# EAGLE design mainboard (EAGLE 7.7.0)
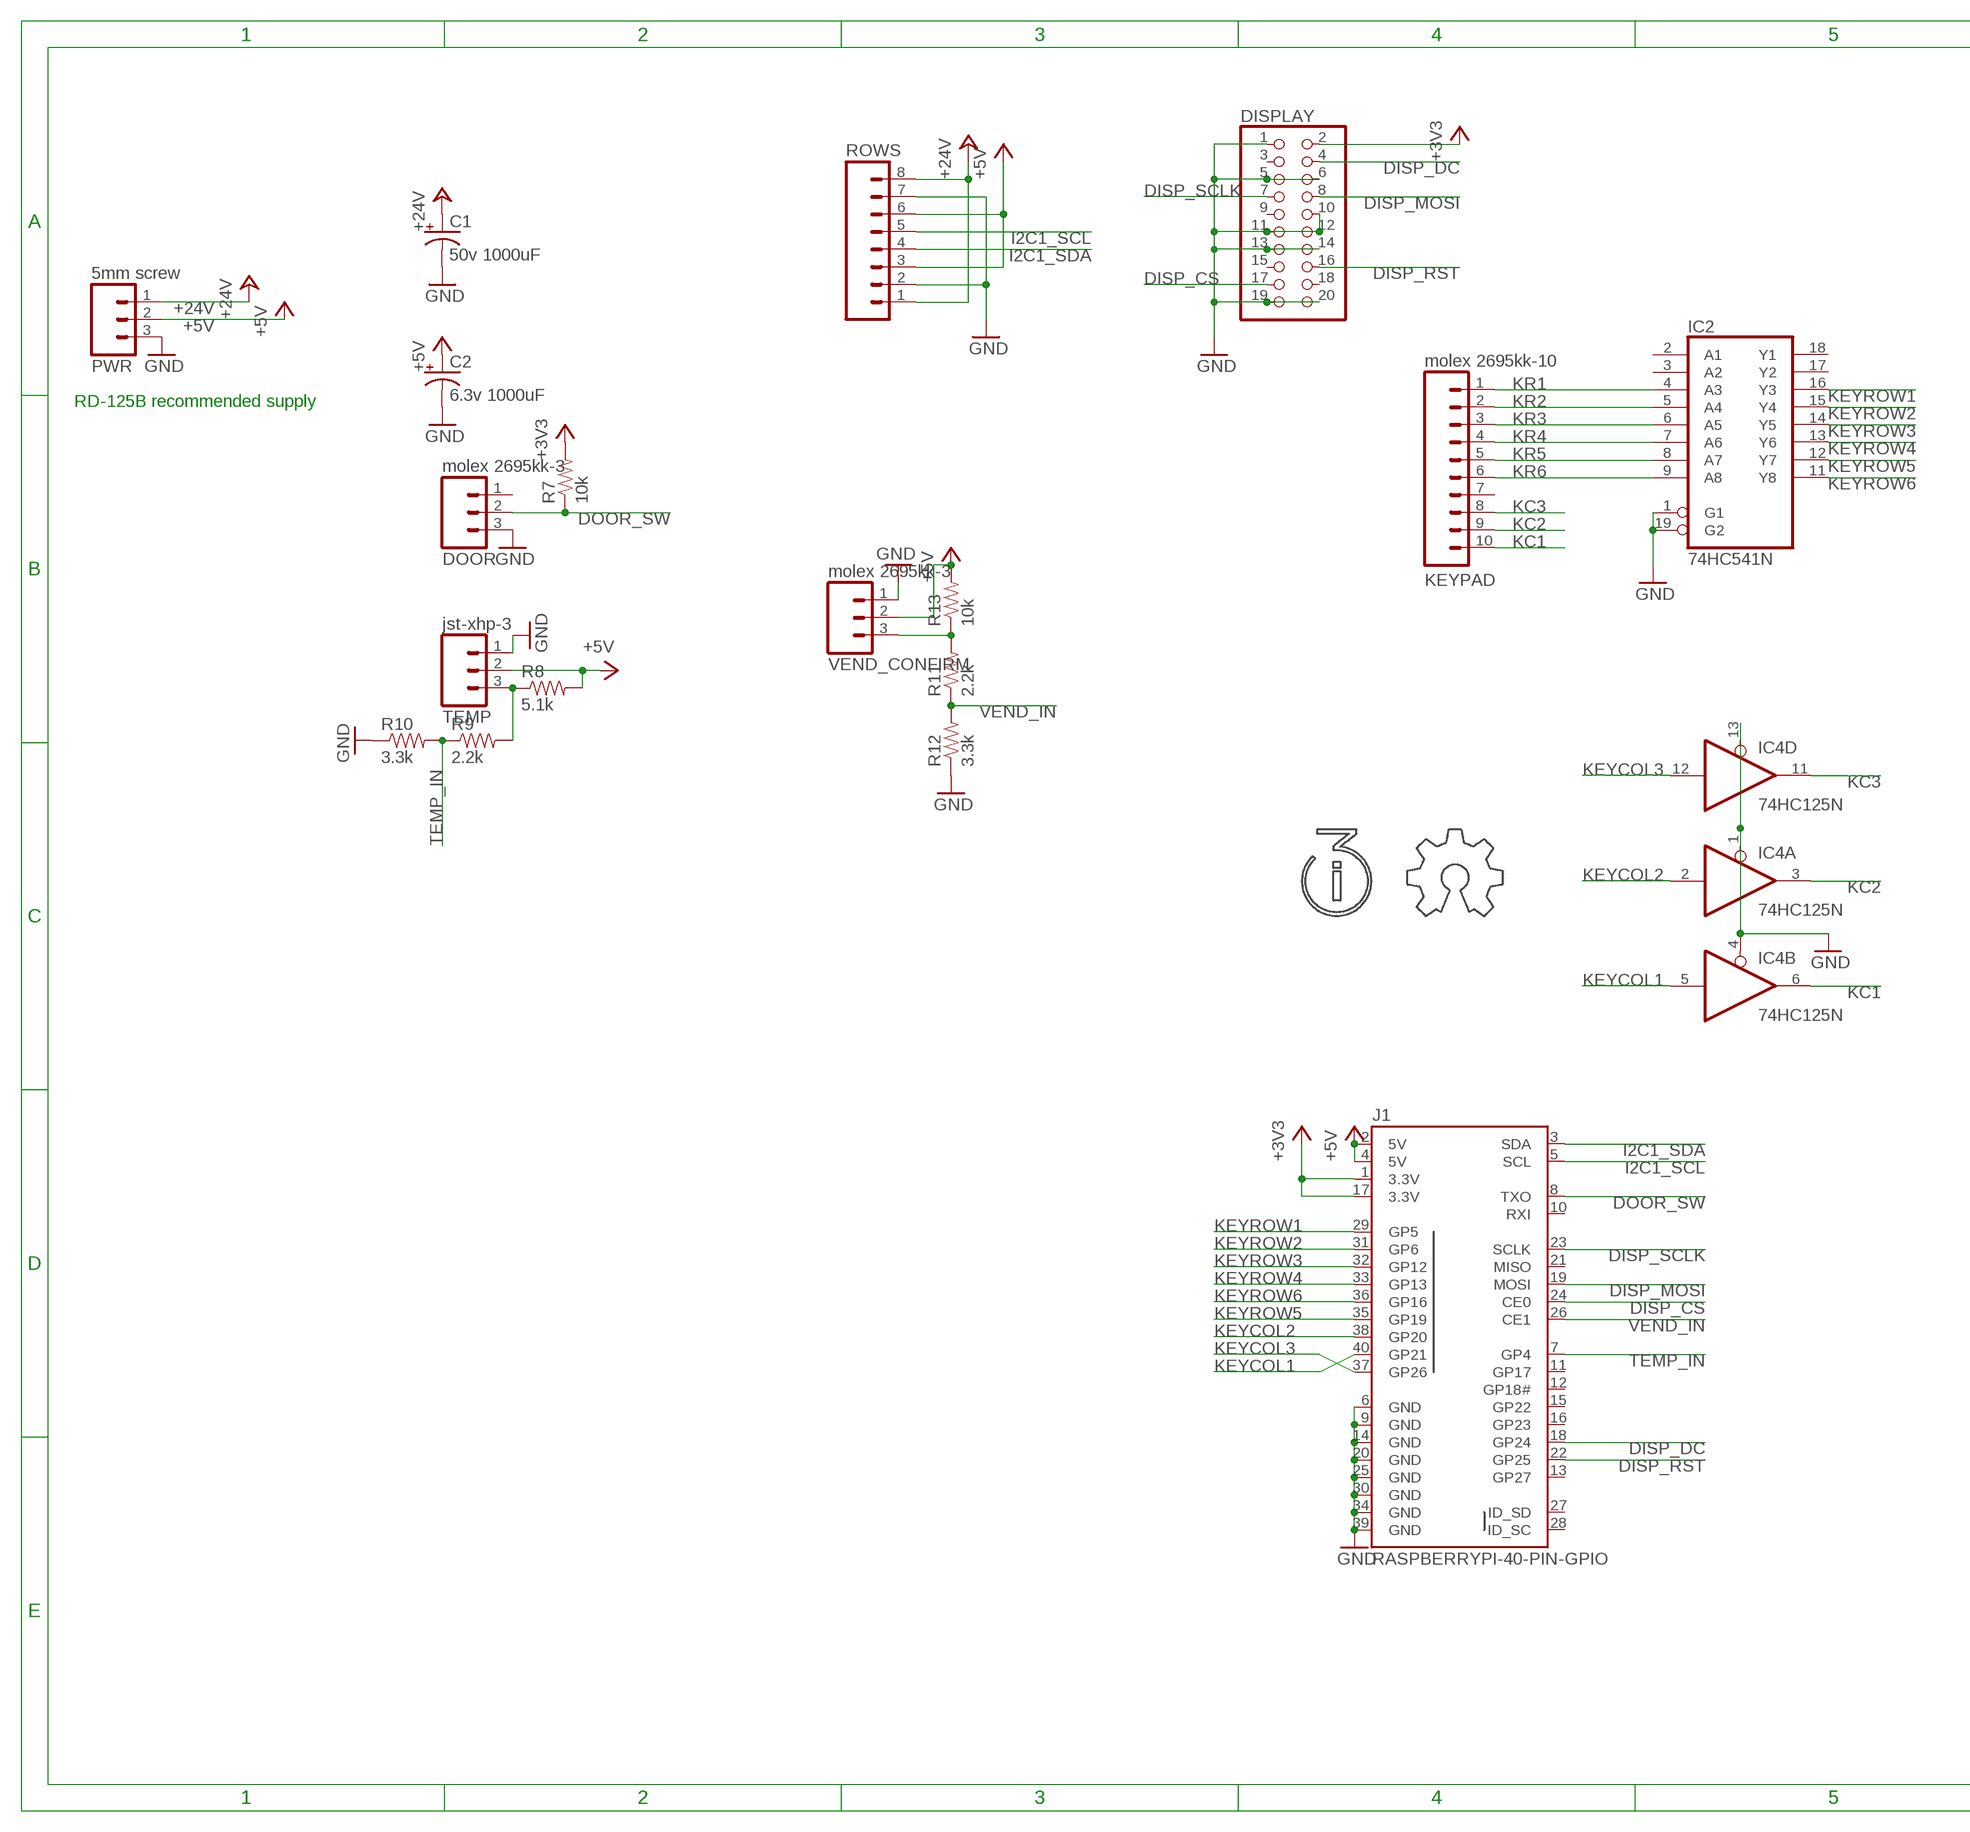
[diagram p0: schematic, sheet 1, part 1 of 2]
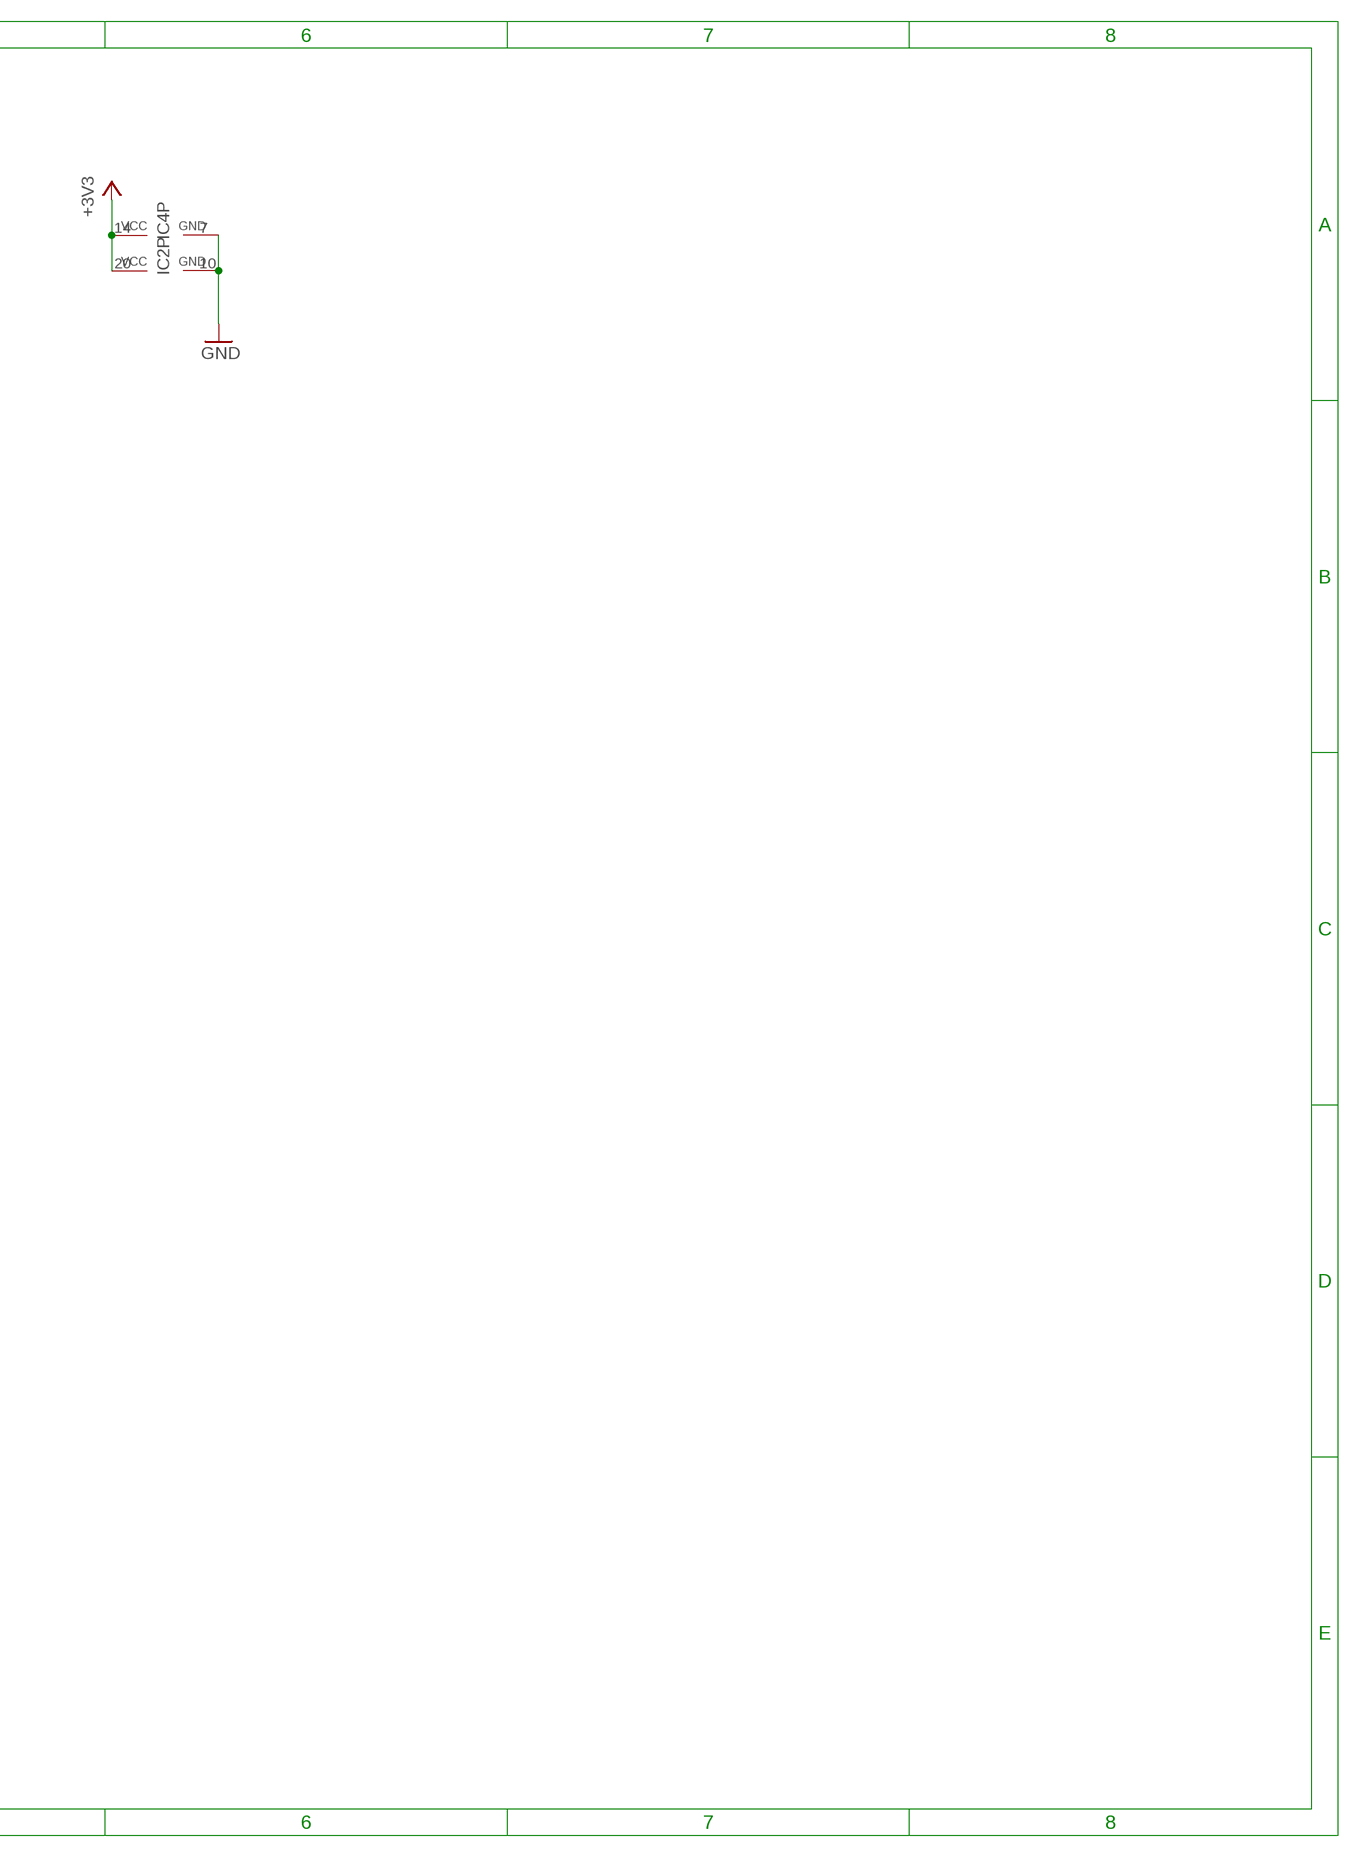
[diagram p1: schematic, sheet 1, part 2 of 2]

## Parts
C1  50v 1000uF  CAP_POLPTH4  [CPOL-RADIAL-1000UF-25V]
C2  6.3v 1000uF  CAP_POLPTH4  [CPOL-RADIAL-1000UF-25V]
DISPLAY  PINHD-2X10  [2X10]
DOOR  molex 2695kk-3  M03POLAR  [MOLEX-1X3]
IC2  74HC541N  [DIL20]
IC4  74HC125N  [DIL14]
J1  RASPBERRYPI-40-PIN-GPIO  [2X20-SHROUDED]
KEYPAD  molex 2695kk-10  M10LOCK  [1X10_LOCK]
PWR  5mm screw  M03-SCREW-5MM  [SCREWTERMINAL-5MM-3]
R7  10k  RESISTOR1206  [1206]
R8  5.1k  RESISTOR1206  [1206]
R9  2.2k  RESISTOR1206  [1206]
R10  3.3k  RESISTOR1206  [1206]
R11  2.2k  RESISTOR1206  [1206]
R12  3.3k  RESISTOR1206  [1206]
R13  10k  RESISTOR1206  [1206]
ROWS  M08FEMALE_LOCK  [1X08_FEMALE_LOCK]
TEMP  jst-xhp-3  M03PTH  [1X03]
U$1  I3LOGO  [I3LOGO]
U$2  OSHWLOGO  [OSHWLOGO]
VEND_CONFIRM  molex 2695kk-3  M03POLAR  [MOLEX-1X3]

## Nets
+3V3: DISPLAY.2 IC2.20(VCC) IC4.14(P:VCC) J1.1(3.3V) J1.17(3.3V) R7.2
+5V: C2.+ J1.2(5V) J1.4(5V) PWR.2 R8.2 R13.2 ROWS.3 ROWS.6 TEMP.2 VEND_CONFIRM.2
+24V: C1.+ PWR.1 ROWS.1 ROWS.8
DISP_CS: DISPLAY.17 J1.24(CE0)
DISP_DC: DISPLAY.4 J1.18(GP24)
DISP_MOSI: DISPLAY.8 J1.19(MOSI)
DISP_RST: DISPLAY.16 J1.22(GP25)
DISP_SCLK: DISPLAY.7 J1.23(SCLK)
DOOR_SW: DOOR.2 J1.8(TXO) R7.1
GND: C1.- C2.- DISPLAY.1 DISPLAY.5 DISPLAY.6 DISPLAY.10 DISPLAY.11 DISPLAY.12 DISPLAY.13 DISPLAY.14 DISPLAY.19 DISPLAY.20 DOOR.3 IC2.1(G1) IC2.10(GND) IC2.19(G2) IC4.1(A:OE) IC4.4(B:OE) IC4.7(P:GND) IC4.13(D:OE) J1.6(GND) J1.9(GND) J1.14(GND) J1.20(GND) J1.25(GND) J1.30(GND) J1.34(GND) J1.39(GND) PWR.3 R10.1 R12.1 ROWS.2 ROWS.7 TEMP.1 VEND_CONFIRM.1
I2C1_SCL: J1.5(SCL) ROWS.5
I2C1_SDA: J1.3(SDA) ROWS.4
KC1: IC4.6(B:O) KEYPAD.10
KC2: IC4.3(A:O) KEYPAD.9
KC3: IC4.11(D:O) KEYPAD.8
KEYCOL1: IC4.5(B:I) J1.40(GP21)
KEYCOL2: IC4.2(A:I) J1.38(GP20)
KEYCOL3: IC4.12(D:I) J1.37(GP26)
KEYROW1: IC2.16(Y3) J1.29(GP5)
KEYROW2: IC2.15(Y4) J1.31(GP6)
KEYROW3: IC2.14(Y5) J1.32(GP12)
KEYROW4: IC2.13(Y6) J1.33(GP13)
KEYROW5: IC2.12(Y7) J1.35(GP19)
KEYROW6: IC2.11(Y8) J1.36(GP16)
KR1: IC2.4(A3) KEYPAD.1
KR2: IC2.5(A4) KEYPAD.2
KR3: IC2.6(A5) KEYPAD.3
KR4: IC2.7(A6) KEYPAD.4
KR5: IC2.8(A7) KEYPAD.5
KR6: IC2.9(A8) KEYPAD.6
N$1: R8.1 R9.2 TEMP.3
N$5: R11.2 R13.1 VEND_CONFIRM.3
TEMP_IN: J1.7(GP4) R9.1 R10.2
VEND_IN: J1.26(CE1) R11.1 R12.2
Unconnected: DISPLAY.3 DISPLAY.9 DISPLAY.15 DISPLAY.18 DOOR.1 IC2.2(A1) IC2.3(A2) IC2.17(Y2) IC2.18(Y1) IC4.8(C:O) IC4.9(C:I) IC4.10(C:OE) J1.10(RXI) J1.11(GP17) J1.12(GP18#) J1.13(GP27) J1.15(GP22) J1.16(GP23) J1.21(MISO) J1.27(ID_SD) J1.28(ID_SC) KEYPAD.7

## Notes on the sheet
- RD-125B recommended supply

## Library data of the parts
C1 C2 = SparkFun-Capacitors:CAP_POL: Capacitor Polarized These are standard SMD and PTH capacitors. Normally 10uF, 47uF, and 100uF in electrolytic and tantalum varieties. Always verify the external diameter of the through hole cap, it varies with capacity, voltage, and manufacturer. The EIA devices should be standard.
DISPLAY = SparkFun-Connectors:PINHD-2X10: PIN HEADER
DOOR TEMP VEND_CONFIRM = SparkFun-Connectors:M03: Header 3 Standard 3-pin 0.1" header. Use with straight break away headers (SKU : PRT-00116), right angle break away headers (PRT-00553), swiss pins (PRT-00743), machine pins (PRT-00117), and female headers (PRT-00115). Molex polarized connector foot print use with SKU : PRT-08232 with associated crimp pins and housings.
IC2 = 74xx-eu:74*541: Octal BUFFER and LINE DRIVER, 3-state
IC4 = 74xx-eu:74*125: Quad bus BUFFER, 3-state
J1 = SparkFun-Boards:RASPBERRYPI-40-PIN-GPIO: Second Generation Raspberry Pi GPIO Header 2x20 pin connector, as found on B, B+, A+ models.
KEYPAD = SparkFun-Connectors:M10: Header 10 Standard 10-pin 0.1" header. Use with straight break away headers (SKU : PRT-00116), right angle break away headers (PRT-00553), swiss pins (PRT-00743), machine pins (PRT-00117), and female headers (PRT-00115).
PWR = SparkFun-Connectors:M03: Header 3 Standard 3-pin 0.1" header. Use with straight break away headers (SKU : PRT-00116), right angle break away headers (PRT-00553), swiss pins (PRT-00743), machine pins (PRT-00117), and female headers (PRT-00115). Molex polarized connector foot print use with SKU : PRT-08232 with associated crimp pins and housings.; STOREFRONT_ID: PRT-08433
R7-R13 = SparkFun-Passives:RESISTOR: Resistor Basic schematic elements and footprints for 0603, 1206, and PTH resistors.
ROWS = SparkFun-Connectors:M08: Header 8 Standard 8-pin 0.1" header. Use with straight break away headers (SKU : PRT-00116), right angle break away headers (PRT-00553), swiss pins (PRT-00743), machine pins (PRT-00117), and female headers (PRT-00115).
U$1 = vending:I3LOGO: The i3Detroit square logo ("i3") as lines in the Info/tNames layers
U$2 = vending:OSHWLOGO: The OSHW logo as lines on Info/tNames layers

## Board
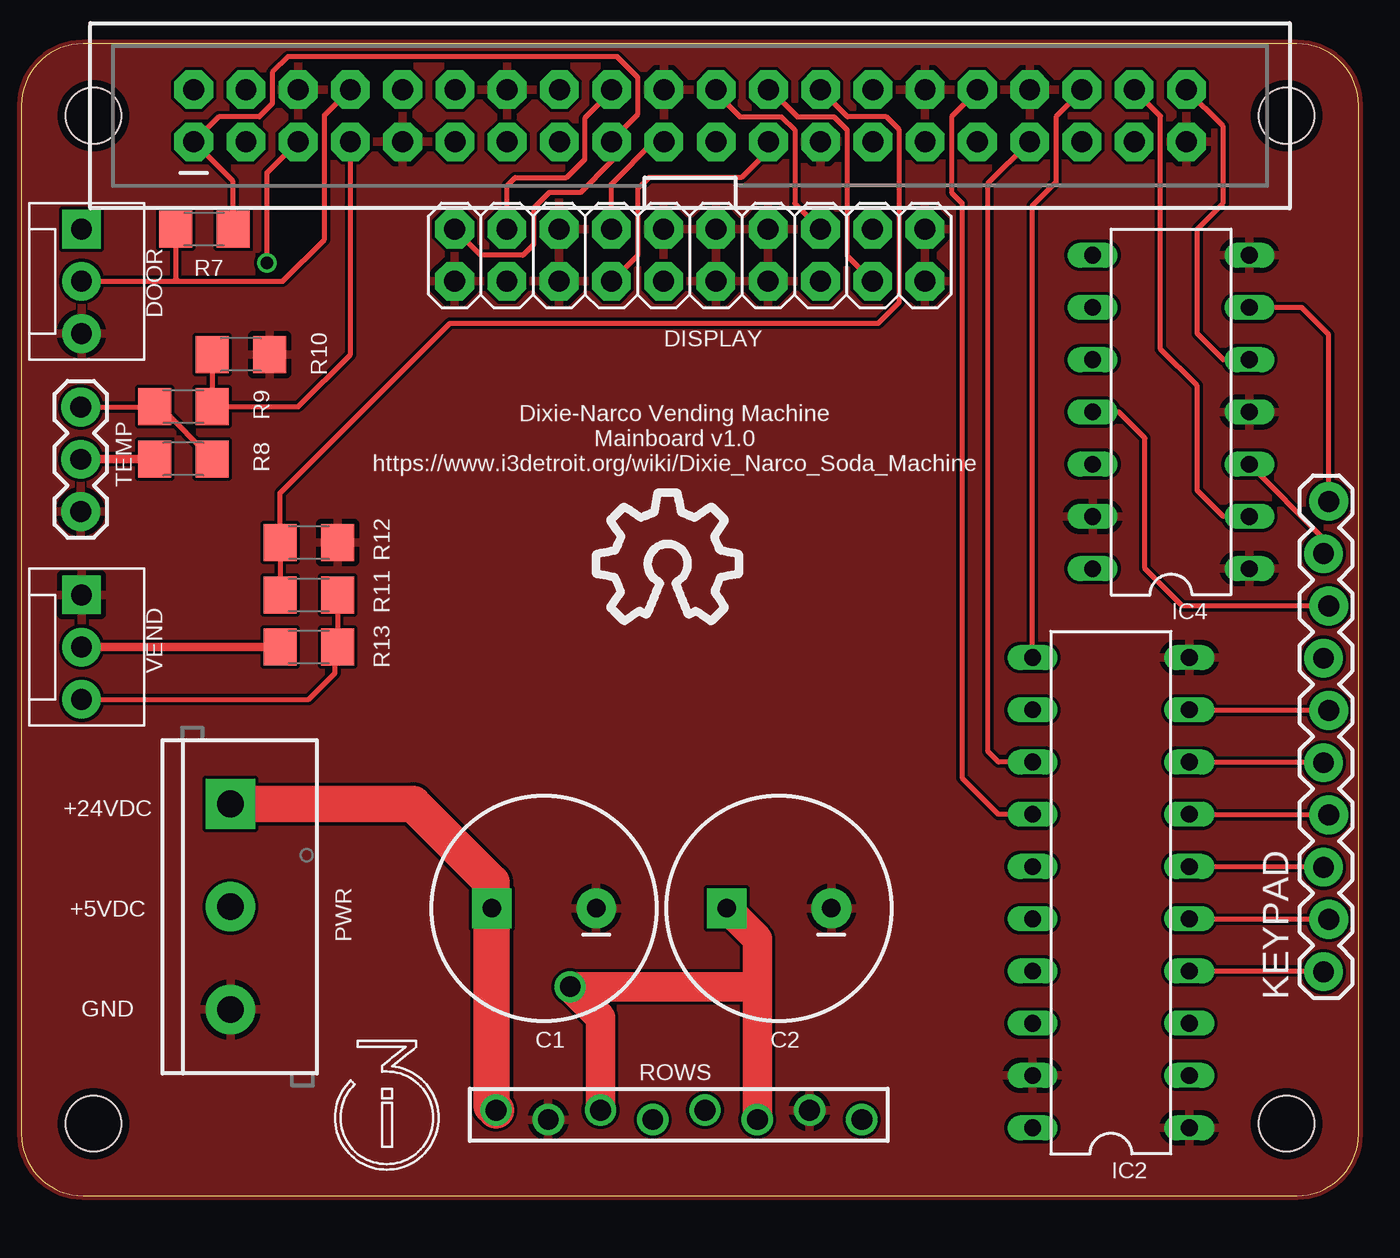
[diagram p2: board, top side]
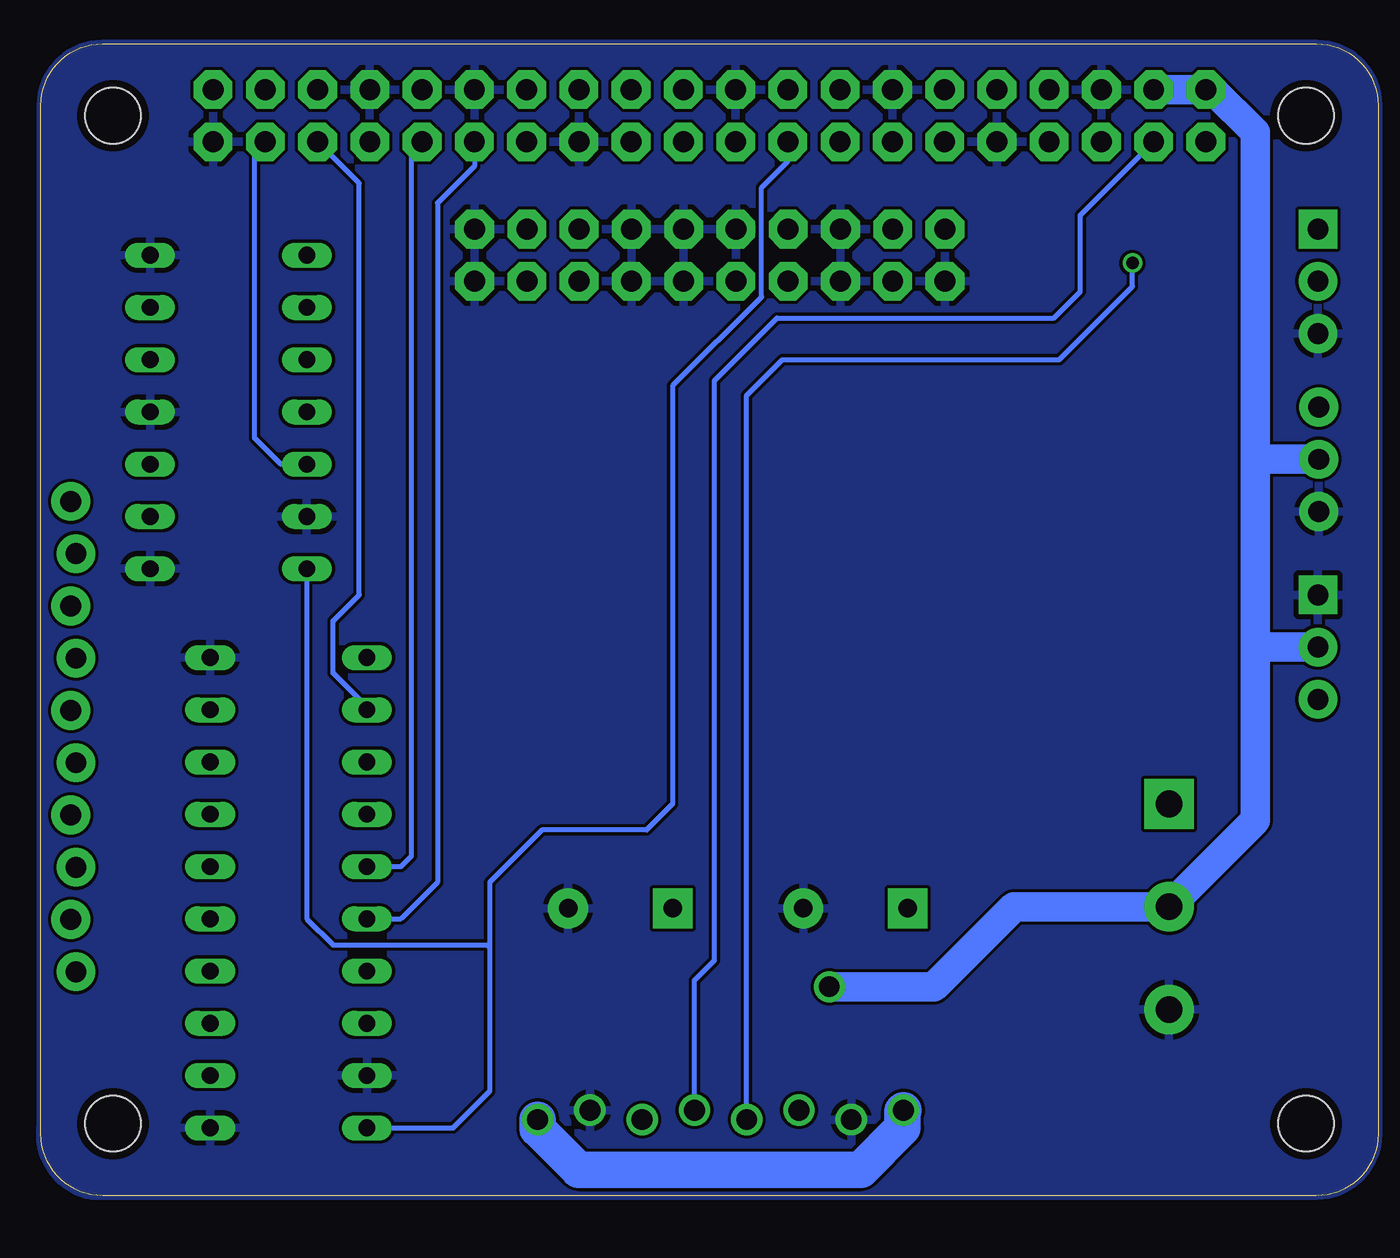
[diagram p3: board, bottom side, seen from below]

No outline drawn. Coordinates in mm, seen from the top.
Copper layers (1*16): Top 0.0356mm / dielectric 1.5011mm / Bottom 0.0356mm
Design rules "LaenPCBOrder *": minimum track width 6mil, minimum drill 13mil, track to track 6mil, track to pad 6mil, pad to pad 6mil, via to via 6mil, smd to smd 6mil, copper to edge 15mil, drill to drill 6mil, minimum pad ring 7mil, minimum via ring 7mil, stop-mask expansion 4mil, vias tented up to drill 0mil, thermal gap 10mil
Holes 2.7 mm at 3.5,3.5 3.5,52.5 61.5,52.5 61.5,3.5
tKeepout: area 61.5,3.5 to 61.5,3.5; area 3.5,3.5 to 3.5,3.5
bKeepout: area 61.5,3.5 to 61.5,3.5; area 3.5,3.5 to 3.5,3.5
Milling: 8 lines

### Footprints (pad centres in the part's own frame; a part is rotated, then mirrored left to right if it is on the bottom)
CPOL-RADIAL-1000UF-25V = drill 0.9 pad 1.93 square: + 2.54,0 | drill 0.9 pad 1.93: - -2.54,0
2X10 = drill 1.016 pad 1.88 octagon: 1 -11.43,-1.27; 2 -11.43,1.27; 3 -8.89,-1.27; 4 -8.89,1.27; 5 -6.35,-1.27; 6 -6.35,1.27; 7 -3.81,-1.27; 8 -3.81,1.27; 9 -1.27,-1.27; 10 -1.27,1.27; 11 1.27,-1.27; 12 1.27,1.27; 13 3.81,-1.27; 14 3.81,1.27; 15 6.35,-1.27; 16 6.35,1.27; 17 8.89,-1.27; 18 8.89,1.27; 19 11.43,-1.27; 20 11.43,1.27
MOLEX-1X3 = drill 1.016 pad 1.88 square: 1 0,0 | drill 1.016 pad 1.88: 2 2.54,0; 3 5.08,0
DIL20 = drill 0.813 long: 1 -11.43,-3.81; 2 -8.89,-3.81; 3 -6.35,-3.81; 4 -3.81,-3.81; 5 -1.27,-3.81; 6 1.27,-3.81; 7 3.81,-3.81; 8 6.35,-3.81; 9 8.89,-3.81; 10 11.43,-3.81; 11 11.43,3.81; 12 8.89,3.81; 13 6.35,3.81; 14 3.81,3.81; 15 1.27,3.81; 16 -1.27,3.81; 17 -3.81,3.81; 18 -6.35,3.81; 19 -8.89,3.81; 20 -11.43,3.81
DIL14 = drill 0.813 long: 1 -7.62,-3.81; 2 -5.08,-3.81; 3 -2.54,-3.81; 4 0,-3.81; 5 2.54,-3.81; 6 5.08,-3.81; 7 7.62,-3.81; 8 7.62,3.81; 9 5.08,3.81; 10 2.54,3.81; 11 0,3.81; 12 -2.54,3.81; 13 -5.08,3.81; 14 -7.62,3.81
2X20-SHROUDED = drill 1.016 pad 1.88 octagon: 1 -1.27,24.13; 2 1.27,24.13; 3 -1.27,21.59; 4 1.27,21.59; 5 -1.27,19.05; 6 1.27,19.05; 7 -1.27,16.51; 8 1.27,16.51; 9 -1.27,13.97; 10 1.27,13.97; 11 -1.27,11.43; 12 1.27,11.43; 13 -1.27,8.89; 14 1.27,8.89; 15 -1.27,6.35; 16 1.27,6.35; 17 -1.27,3.81; 18 1.27,3.81; 19 -1.27,1.27; 20 1.27,1.27; 21 -1.27,-1.27; 22 1.27,-1.27; 23 -1.27,-3.81; 24 1.27,-3.81; 25 -1.27,-6.35; 26 1.27,-6.35; 27 -1.27,-8.89; 28 1.27,-8.89; 29 -1.27,-11.43; 30 1.27,-11.43; 31 -1.27,-13.97; 32 1.27,-13.97; 33 -1.27,-16.51; 34 1.27,-16.51; 35 -1.27,-19.05; 36 1.27,-19.05; 37 -1.27,-21.59; 38 1.27,-21.59; 39 -1.27,-24.13; 40 1.27,-24.13
1X10_LOCK = drill 1.016 pad 1.88: 1 0,0.127; 2 2.54,-0.127; 3 5.08,0.127; 4 7.62,-0.127; 5 10.16,0.127; 6 12.7,-0.127; 7 15.24,0.127; 8 17.78,-0.127; 9 20.32,0.127; 10 22.86,-0.127
SCREWTERMINAL-5MM-3 = drill 1.3 pad 2.413 square: 1 0,0 | drill 1.3 pad 2.413: 2 5,0; 3 10,0
1206 = smd 1.6 x 1.8: 1 -1.4,0; 2 1.4,0
1X08_FEMALE_LOCK = drill 1.016: 1 0,0.229; 2 2.54,-0.229; 3 5.08,0.229; 4 7.62,-0.229; 5 10.16,0.229; 6 12.7,-0.229; 7 15.24,0.229; 8 17.78,-0.229
1X03 = drill 1.016 pad 1.88: 1 0,0; 2 2.54,0; 3 5.08,0

### Placement (x,y rotation side)
C1  25.4,13.97 180 top
C2  36.83,13.97 180 top
DISPLAY  32.49,45.72 0 top
DOOR  2.92,46.99 270 top
IC2  52.96,14.73 90 top
IC4  55.88,38.1 90 top
J1  32.5,52.5 90 top
KEYPAD  63.42,10.89 90 top
PWR  10.16,19.05 270 top
R7  8.89,46.99 0 top
R8  4.7k  [1206]  7.87,35.81 180 top
R9  7.87,38.35 180 top
R10  10.67,40.89 180 top
R11  13.97,29.21 0 top
R12  13.97,31.75 180 top
R13  13.97,26.67 180 top
ROWS  40.85,3.93 180 top
TEMP  2.88,33.26 90 top
U$1  15.24,1.27 0 top
U$2  27.94,27.94 0 top
VEND_CONFIRM  2.92,29.21 270 top

### Tracks (layer width: path | path; a pad name or v marks a point on that pad's centre or on a via)
+3V3
  Top 0.254: DISPLAY.2 22.33,45.72 24.38,45.72 24.89,46.23 24.89,48.01 25.65,48.77 27.18,48.77 28.69,50.28 J1.17 28.69,51.27 28.68,51.28 29.97,52.58 29.97,54.36 28.96,55.37 12.95,55.37 12.19,54.61 12.19,53.09 11.56,52.45 9.59,52.45 J1.1 10.29,49.31 R7.2
  Bottom 0.254: J1.17 28.69,50.28 29.97,49 29.97,43.69 34.29,39.37 34.29,19.05 35.56,17.78 40.64,17.78 43.18,15.24 43.18,12.06 | 43.18,12.06 43.18,5.08 44.96,3.3 IC2.20 | IC4.14 52.07,13.46 50.8,12.19 43.31,12.19 43.18,12.06
+5V  (via drill 1)
  Top 0.254: 2.87,35.81 TEMP.2 | R8.2
  Top 0.406: TEMP.2 R8.2 | VEND_CONFIRM.2 R13.2
  Top 1.422: C2.+ 35.77,12.49 35.77,10.16 | 35.77,10.16 ROWS.3 | 35.77,10.16 v26.67,10.16 28.15,8.68 ROWS.6
  Bottom 0.254: J1.2
  Bottom 1.422: J1.2 8.05,53.77 5.97,51.69 5.97,35.8 | J1.2 J1.4 | v26.67,10.16 21.59,10.16 17.7,14.05 PWR.2 5.97,18.24 5.97,26.67 | 5.97,26.67 5.97,35.8 | 5.97,35.8 TEMP.2 | VEND_CONFIRM.2 5.97,26.67
+24V
  Top 1.778: PWR.1 19.05,19.05 22.86,15.24 C1.+ 22.86,4.37 ROWS.8
  Bottom 1.778: ROWS.1 40.85,3.26 38.86,1.27 25.15,1.27 23.11,3.3 23.11,4.12 ROWS.8
DISP_CS
  Top 0.254: DISPLAY.17 40.13,45.7 40.13,51.82 39.5,52.45 37.72,52.45 36.4,53.77 J1.24
DISP_DC
  Top 0.254: DISPLAY.4 23.6,49.1 24,49.5 26.5,49.5 27.37,50.37 27.37,52.37 28.69,53.69 J1.18
DISP_MOSI
  Top 0.254: DISPLAY.8 28.68,49.18 30.73,51.23 J1.19
DISP_RST
  Top 0.254: DISPLAY.16 37.59,48.23 37.59,51.82 36.96,52.45 34.92,52.45 33.76,53.62 33.77,53.63 J1.22
DISP_SCLK
  Top 0.254: DISPLAY.7 28.7,44.45 29.97,45.72 29.97,48.97 30.5,49.5 35,49.5 36.31,50.81 J1.23
DOOR_SW
  Top 0.254: DOOR.2 7.62,44.45 | 7.62,44.45 12.7,44.45 14.73,46.48 14.73,52.53 14.75,52.53 J1.8 | R7.1 7.49,44.58 7.62,44.45
GND
  pour Bottom: 0,3 arc90 3,0 62.5,0 arc90 65,3.5 65,53 arc90 62,56 3,56 arc90 0,53
  pour Top: 0,53 arc-90 3,56 62,56 arc-90 65,53 65,3 arc-90 62,0 3,0 arc-90 0,3
I2C1_SCL  (via drill 0.6)
  Top 0.254: v11.94,45.34 11.94,49.73 11.95,49.73 J1.5
  Bottom 0.254: v11.94,45.34 11.94,44.2 15.49,40.64 28.96,40.64 30.69,38.91 ROWS.5
I2C1_SDA
  Bottom 0.254: ROWS.4 33.23,10.46 32.26,11.43 32.26,39.62 29.21,42.67 15.75,42.67 14.48,43.94 14.48,47.66 J1.3
KC1
  Top 0.254: KEYPAD.10 63.55,41.86 62.23,43.18 IC4.6
KC2
  Top 0.254: KEYPAD.9 63.29,31.96 IC4.3
KC3
  Top 0.254: KEYPAD.8 56.42,28.67 54.61,30.48 54.61,36.83 53.34,38.1 IC4.11
KEYCOL1
  Top 0.254: IC4.5 58.42,40.64 57.15,41.91 57.15,46.99 58.42,48.26 58.42,51.98 J1.40
KEYCOL2
  Top 0.254: IC4.2 58.42,33.02 57.15,34.29 57.15,39.37 55.37,41.15 55.37,52.49 J1.38
KEYCOL3
  Bottom 0.254: IC4.12 53.34,35.56 54.61,36.83 54.61,50.71 J1.37
KEYROW1
  Bottom 0.254: J1.29 43.93,50.05 45.72,48.26 45.72,15.24 47.5,13.46 IC2.16
KEYROW2
  Bottom 0.254: IC2.15 47.5,16 46.99,16.51 46.99,50.71 J1.31
KEYROW3
  Top 0.254: J1.32 46.47,53.71 45.21,52.45 45.21,48.77 45.72,48.26 45.72,20.32 47.5,18.54 IC2.14
KEYROW4
  Top 0.254: IC2.13 47.5,21.08 46.99,21.59 46.99,49.21 J1.33
KEYROW5
  Bottom 0.254: IC2.12 49.15,23.75 50.8,25.4 50.8,27.94 49.53,29.21 49.53,49.21 J1.35
KEYROW6
  Top 0.254: IC2.11 49.15,48.13 50.29,49.28 50.29,52.45 51.55,53.71 J1.36
KR1
  Top 0.254: IC2.4 63.29,10.92
  Top 0.406: 63.29,10.92 KEYPAD.1
KR2
  Top 0.254: KEYPAD.2 56.77,13.43
  Top 0.406: 56.77,13.43 IC2.5
KR3
  Top 0.254: IC2.6 63.29,16
  Top 0.406: 63.29,16 KEYPAD.3
KR4
  Top 0.254: KEYPAD.4 56.77,18.51
  Top 0.406: 56.77,18.51 IC2.7
KR5
  Top 0.254: IC2.8 63.29,21.08
  Top 0.406: 63.29,21.08 KEYPAD.5
KR6
  Top 0.254: KEYPAD.6 56.77,23.59
  Top 0.406: 56.77,23.59 IC2.9
N$1
  Top 0.254: TEMP.3 R9.2 6.73,38.35 R8.1
N$5
  Top 0.254: R11.2 R13.1 15.24,26.54 15.24,25.4 13.97,24.13 VEND_CONFIRM.3
TEMP_IN
  Top 0.254: R10.2 R9.1 13.46,38.35 16,40.89 16,51.22 J1.7
VEND_IN
  Top 0.254: R11.1 R12.2 12.57,34.16 20.83,42.42 41.66,42.42 42.67,43.43 42.67,51.82 42.04,52.45 40.16,52.45 38.85,53.76 J1.26

### Text on the board
tNames: DOOR | Dixie-Narco Vending Machine / Mainboard v1.0 / https://www.i3detroit.org/wiki/Dixie_Narco_Soda_Machine | VEND | +24VDC / / / / +5VDC / / / / GND